# EAGLE design PCB-JACKGPO (EAGLE 6.4)
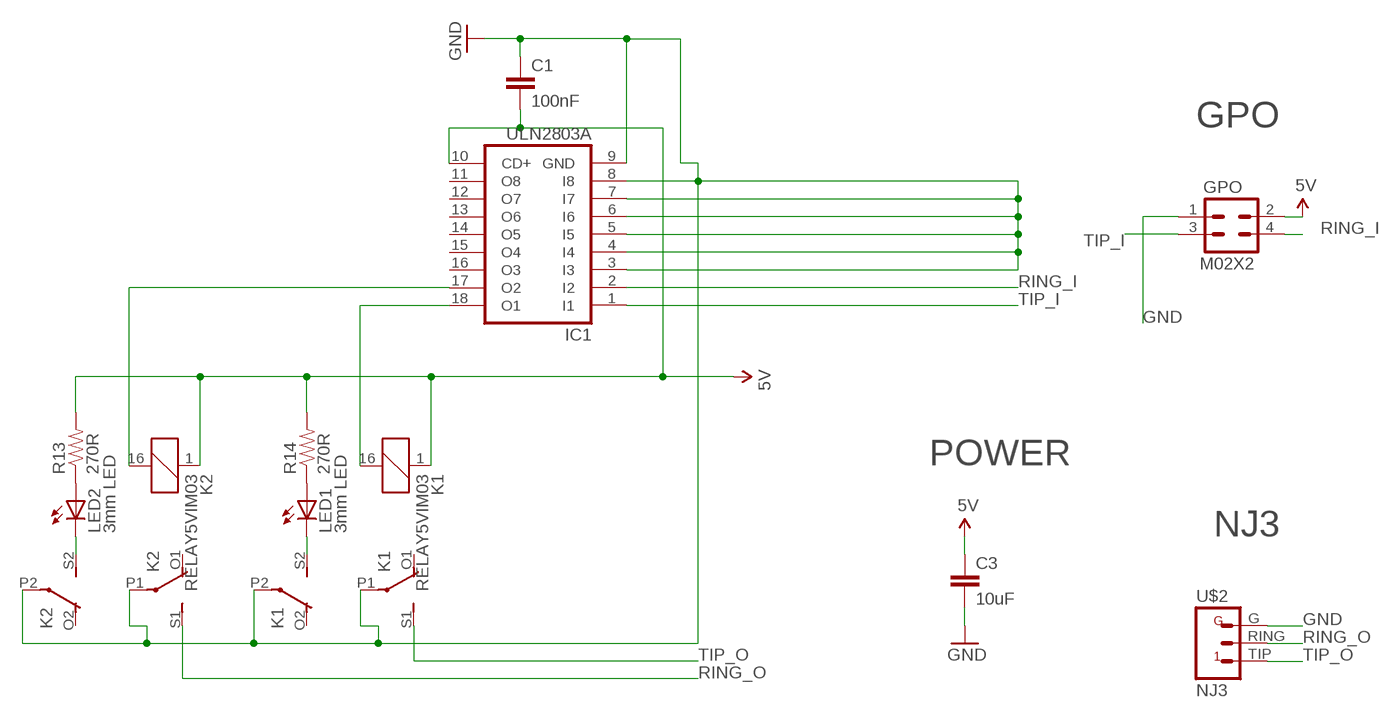
[diagram p0: schematic, sheet 1]

## Parts
C1  100nF  CAP0805  [0805]
C3  10uF  CAP0805  [0805]
GPO  M02X2  [2X2]
IC1  ULN2803A  ULN2803ASO18W  [SO18W]
K1  RELAY5VIM03  [DS2Y]
K2  RELAY5VIM03  [DS2Y]
LED1  3mm LED  LED3MM  [LED3MM]
LED2  3mm LED  LED3MM  [LED3MM]
R13  270R  RESISTOR0603-RES  [0603-RES]
R14  270R  RESISTOR0603-RES  [0603-RES]
U$2  NJ3  [NJ3FP6C]

## Nets
5V [PWR]: C1.2 C3.1 GPO.2 IC1.10(CD+) K1.1 K2.1 R13.2 R14.2
GND [PWR]: C1.1 C3.2 GPO.1 IC1.3(I3) IC1.4(I4) IC1.5(I5) IC1.6(I6) IC1.7(I7) IC1.8(I8) IC1.9(GND) K1.P1(2:P) K1.P2(3:P) K2.P1(2:P) K2.P2(3:P) U$2.G
N$2: K1.S2(3:S) LED1.K(C)
N$5: IC1.18(O1) K1.16
N$8: K2.S2(3:S) LED2.K(C)
N$9: IC1.17(O2) K2.16
N$45: LED2.A R13.1
N$46: LED1.A R14.1
RING_I: GPO.4 IC1.2(I2)
RING_O [RELAY LINES]: K2.S1(2:S) U$2.RING
TIP_I: GPO.3 IC1.1(I1)
TIP_O [RELAY LINES]: K1.S1(2:S) U$2.TIP
Unconnected: IC1.11(O8) IC1.12(O7) IC1.13(O6) IC1.14(O5) IC1.15(O4) IC1.16(O3) K1.O1(2:O) K1.O2(3:O) K2.O1(2:O) K2.O2(3:O)

## Notes on the sheet
- GPO
- POWER
- NJ3

## Library data of the parts
C1 C3 = SparkFun:CAP: Capacitor Standard 0603 ceramic capacitor, and 0.1" leaded capacitor.
GPO = SKAARHOJ:M02X2
IC1 = uln-udn:ULN2803A: DRIVER ARRAY
K1 K2 = SKAARHOJ:RELAY5V: RELAY 2 x switch, AxiCom 150 mW 5V
LED1 LED2 = SparkFun:LED: LEDs Standard schematic elements and footprints for 5mm, 3mm, 1206, and 0603 sized LEDs. 5mm - Spark Fun Electronics SKU : COM-00529 (and others)
R13 R14 = SparkFun:RESISTOR: Resistor Basic schematic elements and footprints for 0603, 1206, and PTH resistors.
U$2 = SKAARHOJ:NJ3

## Net classes
0 default: width 0.203 mm, drill 0.406 mm, clearance 0.203 mm
1 PWR: width 0.406 mm, drill 0.61 mm, clearance 0.203 mm
2 RELAY LINES: width 0.406 mm, drill 0.61 mm, clearance 0.203 mm
3 INput lines: width 0.203 mm, drill 0.406 mm, clearance 0.203 mm

## Board
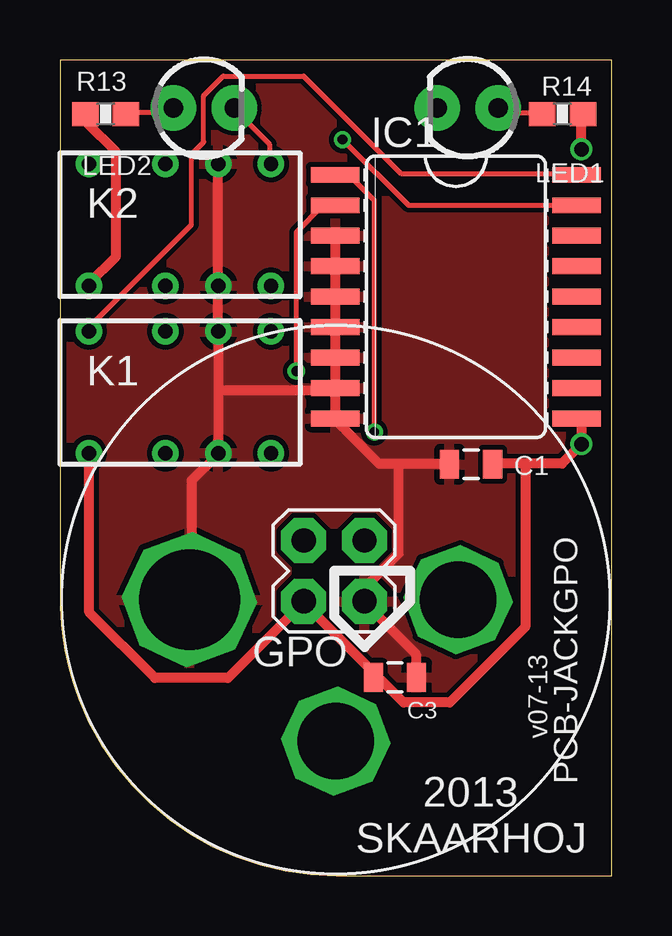
[diagram p1: board, top side]
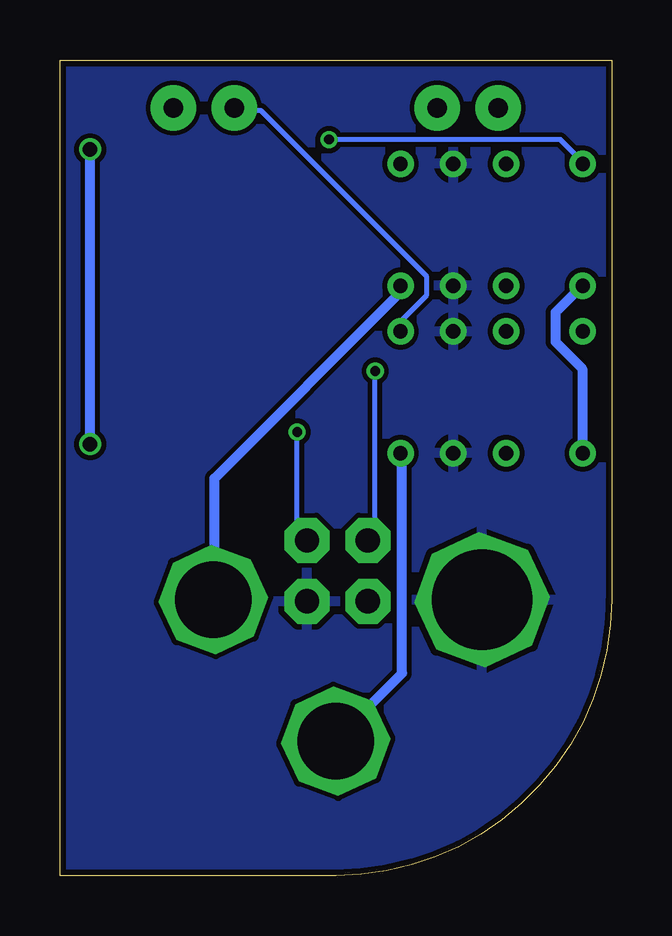
[diagram p2: board, bottom side, seen from below]

Size 23 x 34 mm. Coordinates in mm from the lower left corner, seen from the top.
Outline: 11.5,0 23,0 23,34 0,34 0,11.5 arc90 11.5,0
Copper layers (1*16): Top 0.035mm / dielectric 1.5mm / Bottom 0.035mm
Design rules "Fusion_eagle_rule_v1.1": minimum track width 6mil, minimum drill 12mil, track to track 6mil, track to pad 6mil, pad to pad 6mil, via to via 6mil, smd to smd 0mil, copper to edge 10mil, drill to drill 10mil, minimum pad ring 10mil, minimum via ring 6mil, stop-mask expansion 2mil, vias tented up to drill 100mil, thermal gap 10mil

### Footprints (pad centres in the part's own frame; a part is rotated, then mirrored left to right if it is on the bottom)
0805 = smd 0.8 x 1.2: 1 -0.9,0; 2 0.9,0
2X2 = drill 1.016 pad 1.88 octagon: 1 -3.81,-1.27; 2 -3.81,1.27; 3 -1.27,-1.27; 4 -1.27,1.27
SO18W = smd 0.66 x 2.032: 1 -5.08,-5.029; 2 -3.81,-5.029; 3 -2.54,-5.029; 4 -1.27,-5.029; 5 0,-5.029; 6 1.27,-5.029; 7 2.54,-5.029; 8 3.81,-5.029; 9 5.08,-5.029; 10 5.08,5.029; 11 3.81,5.029; 12 2.54,5.029; 13 1.27,5.029; 14 0,5.029; 15 -1.27,5.029; 16 -2.54,5.029; 17 -3.81,5.029; 18 -5.08,5.029
DS2Y = drill 0.6: 1 1.2,0.46; 16 1.2,5.54; O1 4.4,0.46; O2 4.4,5.54; P1 6.6,0.46; P2 6.6,5.54; S1 8.8,0.46; S2 8.8,5.54
LED3MM = drill 0.813 pad 1.88: A -1.27,0; K 1.27,0
0603-RES = smd 1.1 x 1: 1 -0.85,0; 2 0.85,0
NJ3FP6C = drill 4.2 octagon: G -6.1,0 | drill 3.2 octagon: RING 5.1,0; TIP 0,-5.9

### Placement (x,y rotation side)
C1  17.14,17.14 0 top
C3  13.97,8.26 0 top
GPO  11.43,15.24 90 top
IC1  16.51,24.13 270 top
K1  0,17.14 0 top
K2  0,24.13 0 top
LED1  17,32 180 top
LED2  6,32 0 top
R13  1.91,31.75 180 top
R14  20.95,31.75 0 top
U$2  11.5,11.5 0 top

### Tracks (layer width: path | path; a pad name or v marks a point on that pad's centre or on a via)
5V  (via drill 0.61)
  Top 0.406: R13.2 1.12,31.7 1.12,31.39 2.34,30.18 2.34,25.81 1.22,24.69 K2.1 | v21.74,30.28 21.74,31.7 R14.2 | IC1.10 21.54,19 21.74,18.8 v21.74,17.98 20.93,17.17 19.41,17.17 | 19.41,17.17 18.09,17.17 C1.2 | 19.41,17.17 19.41,10.36 16.26,7.21 14.33,7.21 13.41,8.13 13.21,8.13 C3.1 13.01,8.33 13.01,8.53 10.16,11.38 GPO.2 10.06,11.28 7.01,8.23 3.96,8.23 1.22,10.97 1.22,17.58 K1.1
  Bottom 0.406: K1.1 1.22,17.68 1.22,21.13 2.34,22.25 2.34,23.47 1.22,24.59 K2.1 | v21.74,17.98 v21.74,30.28
GND
  Top 0.406: 6.6,20.22 6.6,22.66 K1.P2 6.6,22.86 K2.P1 6.6,24.79 K2.P2 | 6.6,20.22 6.6,17.68 K1.P1 6.5,17.48 5.49,16.46 5.49,11.58 U$2.G | C3.2 14.83,8.33 14.83,9.25 12.7,11.38 GPO.1 12.8,11.58 12.8,12.09 14.12,13.41 14.12,17.17 | 14.12,17.17 13.31,17.17 11.48,19 IC1.9 | 14.12,17.17 16.15,17.17 C1.1 | 11.48,19.1 IC1.9 | IC1.9 IC1.8 | IC1.8 IC1.7 IC1.6 IC1.5 IC1.4 IC1.3 | 6.6,20.22 11.38,20.22 IC1.8
  pour Top: 0,0 22.86,0 22.86,34.29 0,34.29
  pour Bottom: 0,0 22.86,0 22.86,34.29 0,34.29
N$2
  Bottom 0.203: K1.S2 8.74,22.76 8.74,23.16 7.72,24.18 7.72,24.99 14.63,31.9 15.65,31.9 LED1.K
N$5
  Top 0.203: IC1.18 21.54,29.26 14.22,29.26 10.16,33.33 6.81,33.33 5.99,32.51 5.99,30.58 5.49,30.07 5.49,27.13 1.12,22.76 K1.16
N$8
  Top 0.203: K2.S2 8.74,29.77 8.74,30.48 7.32,31.9 LED2.K
N$9  (via drill 0.41)
  Top 0.203: IC1.17 14.53,27.94 v11.79,30.68
  Bottom 0.203: v11.79,30.68 2.13,30.68 1.22,29.77 K2.16
N$45
  Top 0.203: R13.1 2.85,31.8 4.57,31.8 4.67,31.9 LED2.A
N$46
  Top 0.203: R14.1 20.02,31.8 18.39,31.8 18.29,31.9 LED1.A
RING_I  (via drill 0.41)
  Top 0.203: IC1.2 10.97,27.94 9.86,26.82 v9.86,21.03
  Bottom 0.203: v9.86,21.03 9.86,14.33 10.16,14.02 GPO.4
RING_O
  Bottom 0.406: K2.S1 8.84,24.59 8.84,24.28 16.56,16.56 16.56,11.58 U$2.RING
TIP_I  (via drill 0.41)
  Top 0.203: v13.11,18.49 13.11,28.14 12.09,29.16 11.48,29.16 IC1.1
  Bottom 0.203: v13.11,18.49 13.11,14.43 12.7,14.02 GPO.3
TIP_O
  Bottom 0.406: K1.S1 8.74,17.58 8.74,8.43 11.48,5.69 U$2.TIP

### Text on the board
_tsilk: v07-13 | PCB-JACKGPO | 2013 / SKAARHOJ